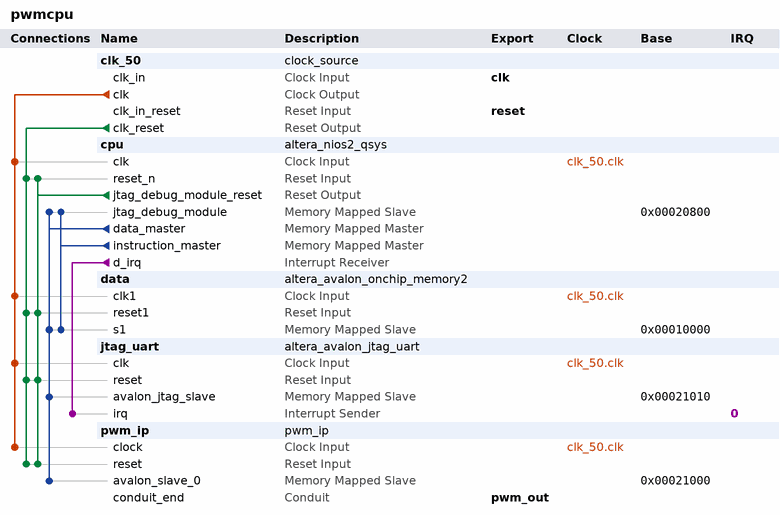
[diagram p0: system contents]
# Platform Designer (Qsys) system pwmcpu, Cyclone IV E EP4CE115F29C7
# Parameters at their usual value, and those the tool derives, are not listed.
package require -exact qsys 13.0
create_system pwmcpu
set_project_property DEVICE_FAMILY {Cyclone IV E}
set_project_property DEVICE EP4CE115F29C7

add_instance clk_50 clock_source 13.0
set_instance_parameter_value clk_50 clockFrequency 50000000

add_instance cpu altera_nios2_qsys 13.0
set_instance_parameter_value cpu resetSlave data.s1
set_instance_parameter_value cpu mmu_TLBMissExcSlave None
set_instance_parameter_value cpu exceptionSlave data.s1
set_instance_parameter_value cpu breakSlave cpu.jtag_debug_module
set_instance_parameter_value cpu impl Tiny
set_instance_parameter_value cpu icache_size 4096

add_instance data altera_avalon_onchip_memory2 13.0.1
set_instance_parameter_value data dataWidth 32
set_instance_parameter_value data dualPort false
set_instance_parameter_value data initMemContent true
set_instance_parameter_value data initializationFileName onchip_mem.hex
set_instance_parameter_value data memorySize 40960

add_instance jtag_uart altera_avalon_jtag_uart 13.0.1
set_instance_parameter_value jtag_uart simInteractiveOptions NO_INTERACTIVE_WINDOWS

add_instance pwm_ip pwm_ip 1.0

# connections
add_connection clk_50.clk cpu.clk clock
add_connection clk_50.clk data.clk1 clock
add_connection clk_50.clk jtag_uart.clk clock
add_connection clk_50.clk pwm_ip.clock clock
add_connection clk_50.clk_reset cpu.reset_n reset
add_connection clk_50.clk_reset data.reset1 reset
add_connection clk_50.clk_reset jtag_uart.reset reset
add_connection clk_50.clk_reset pwm_ip.reset reset
add_connection cpu.jtag_debug_module_reset cpu.reset_n reset
add_connection cpu.jtag_debug_module_reset data.reset1 reset
add_connection cpu.jtag_debug_module_reset jtag_uart.reset reset
add_connection cpu.jtag_debug_module_reset pwm_ip.reset reset
add_connection cpu.data_master cpu.jtag_debug_module avalon
set_connection_parameter_value cpu.data_master/cpu.jtag_debug_module baseAddress 0x00020800
add_connection cpu.data_master data.s1 avalon
set_connection_parameter_value cpu.data_master/data.s1 baseAddress 0x00010000
add_connection cpu.data_master jtag_uart.avalon_jtag_slave avalon
set_connection_parameter_value cpu.data_master/jtag_uart.avalon_jtag_slave baseAddress 0x00021010
add_connection cpu.data_master pwm_ip.avalon_slave_0 avalon
set_connection_parameter_value cpu.data_master/pwm_ip.avalon_slave_0 baseAddress 0x00021000
add_connection cpu.instruction_master cpu.jtag_debug_module avalon
set_connection_parameter_value cpu.instruction_master/cpu.jtag_debug_module baseAddress 0x00020800
add_connection cpu.instruction_master data.s1 avalon
set_connection_parameter_value cpu.instruction_master/data.s1 baseAddress 0x00010000
add_connection cpu.d_irq jtag_uart.irq interrupt
set_connection_parameter_value cpu.d_irq/jtag_uart.irq irqNumber 0

# exported interfaces
add_interface clk clock sink
set_interface_property clk EXPORT_OF clk_50.clk_in
add_interface reset reset sink
set_interface_property reset EXPORT_OF clk_50.clk_in_reset
add_interface pwm_out conduit end
set_interface_property pwm_out EXPORT_OF pwm_ip.conduit_end

set_interconnect_requirement {$system} qsys_mm.clockCrossingAdapter HANDSHAKE
set_interconnect_requirement {$system} qsys_mm.maxAdditionalLatency 1

save_system pwmcpu.qsys
